# EAGLE design top_board (EAGLE 9.6.2)
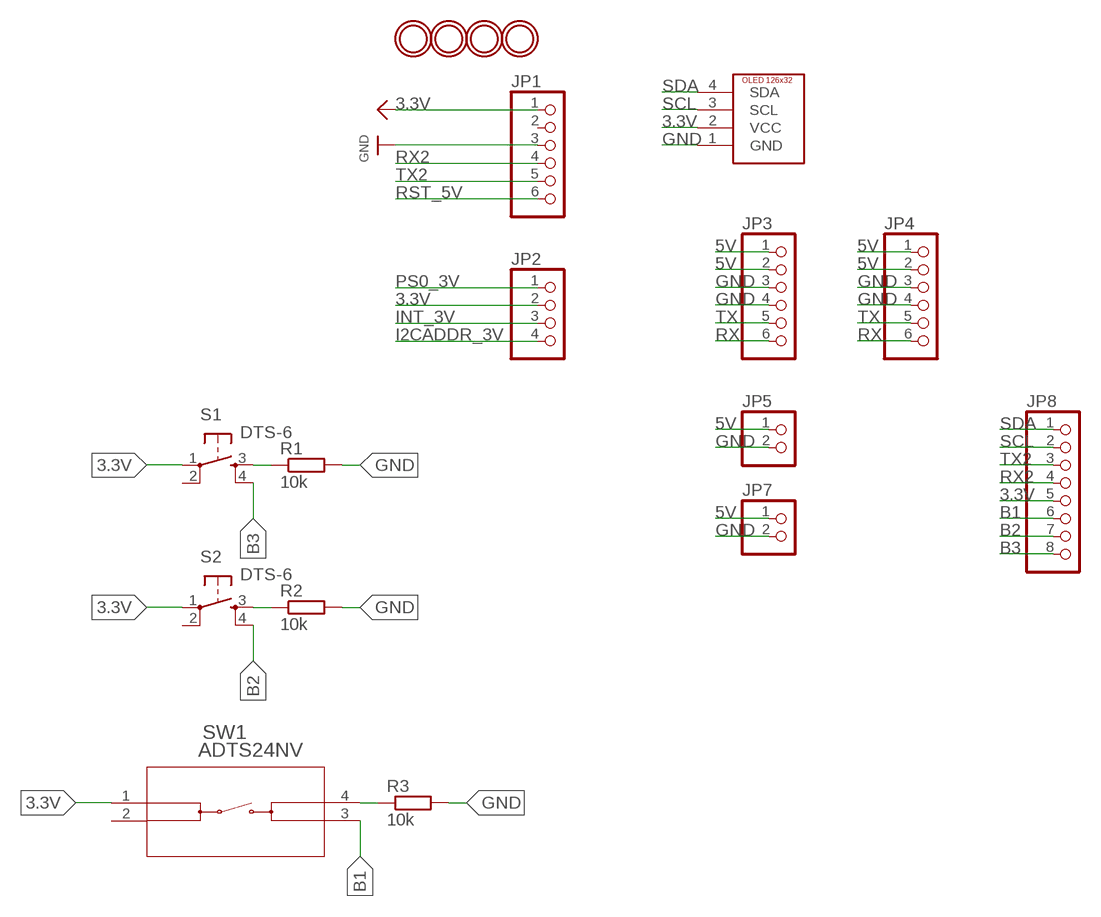
[diagram p0: schematic, sheet 1]

## Parts
JP1  HEADER-1X676MIL  [1X06_ROUND_76]
JP2  HEADER-1X476MIL  [1X04_ROUND_76]
JP3  PINHD-1X6  [1X06]
JP4  PINHD-1X6  [1X06]
JP5  PINHD-1X2  [1X02]
JP7  PINHD-1X2  [1X02]
JP8  PINHD-1X8  [1X08]
R1  10k  R-EU_R0603  [R0603]
R2  10k  R-EU_R0603  [R0603]
R3  10k  R-EU_R0603  [R0603]
S1  DTS-6  [DTS-6]
S2  DTS-6  [DTS-6]
SW1  ADTS24NV  [ADTS24*V_APM]
U$1  OLED126X32THROUGH_HOLE  [OLED128X64]
U$29  MOUNTINGHOLE2.5_THICK  [MOUNTINGHOLE_2.5_PLATED_THICK]
U$30  MOUNTINGHOLE2.5_THICK  [MOUNTINGHOLE_2.5_PLATED_THICK]
U$31  MOUNTINGHOLE2.5_THICK  [MOUNTINGHOLE_2.5_PLATED_THICK]
U$32  MOUNTINGHOLE2.5_THICK  [MOUNTINGHOLE_2.5_PLATED_THICK]

## Nets
3.3V: JP1.1 JP2.2 JP8.5 S1.1 S2.1 SW1.1 U$1.2(VCC) ; supply symbol labelled 5.0V
5V: JP3.1 JP3.2 JP4.1 JP4.2 JP5.1 JP7.1
B1: JP8.6 SW1.3
B2: JP8.7 S2.4
B3: JP8.8 S1.4
GND: JP1.3 JP3.3 JP3.4 JP4.3 JP4.4 JP5.2 JP7.2 R1.2 R2.2 R3.2 U$1.1(GND)
I2CADDR_3V: JP2.4
INT_3V: JP2.3
N$1: R1.1 S1.3
N$2: R2.1 S2.3
N$3: R3.1 SW1.4
PS0_3V: JP2.1
RST_5V: JP1.6
RX: JP3.6 JP4.6
RX2: JP1.4 JP8.4
SCL: JP8.2 U$1.3(SCL)
SDA: JP8.1 U$1.4(SDA)
TX: JP3.5 JP4.5
TX2: JP1.5 JP8.3
Unconnected: JP1.2 S1.2 S2.2 SW1.2

## Library data of the parts
JP1 = microbuilder:HEADER-1X6: PIN HEADER
JP2 = microbuilder:HEADER-1X4: PIN HEADER
JP3 JP4 = pinhead:PINHD-1X6: PIN HEADER
JP5 JP7 = pinhead:PINHD-1X2: PIN HEADER
JP8 = pinhead:PINHD-1X8: PIN HEADER
R1-R3 = rcl:R-EU_: RESISTOR, European symbol; SPICEPREFIX: R
S1 S2 = switch-tact:DTS-6
SW1 = big button:ADTS24NV; COPYRIGHT: Copyright (C) 2023 Ultra Librarian. All rights reserved.; MANUFACTURER_PART_NUMBER: ADTS24NV; MFR_NAME: Apem
U$1 = OLED 128x32:OLED126X32
U$29-U$32 = microbuilder:MOUNTINGHOLE: Mounting Hole For #2 screws (0.086"/2.18mm width, 0.094"/2.4mm hole) use 2.5mm; BOM: EXCLUDE

## Board
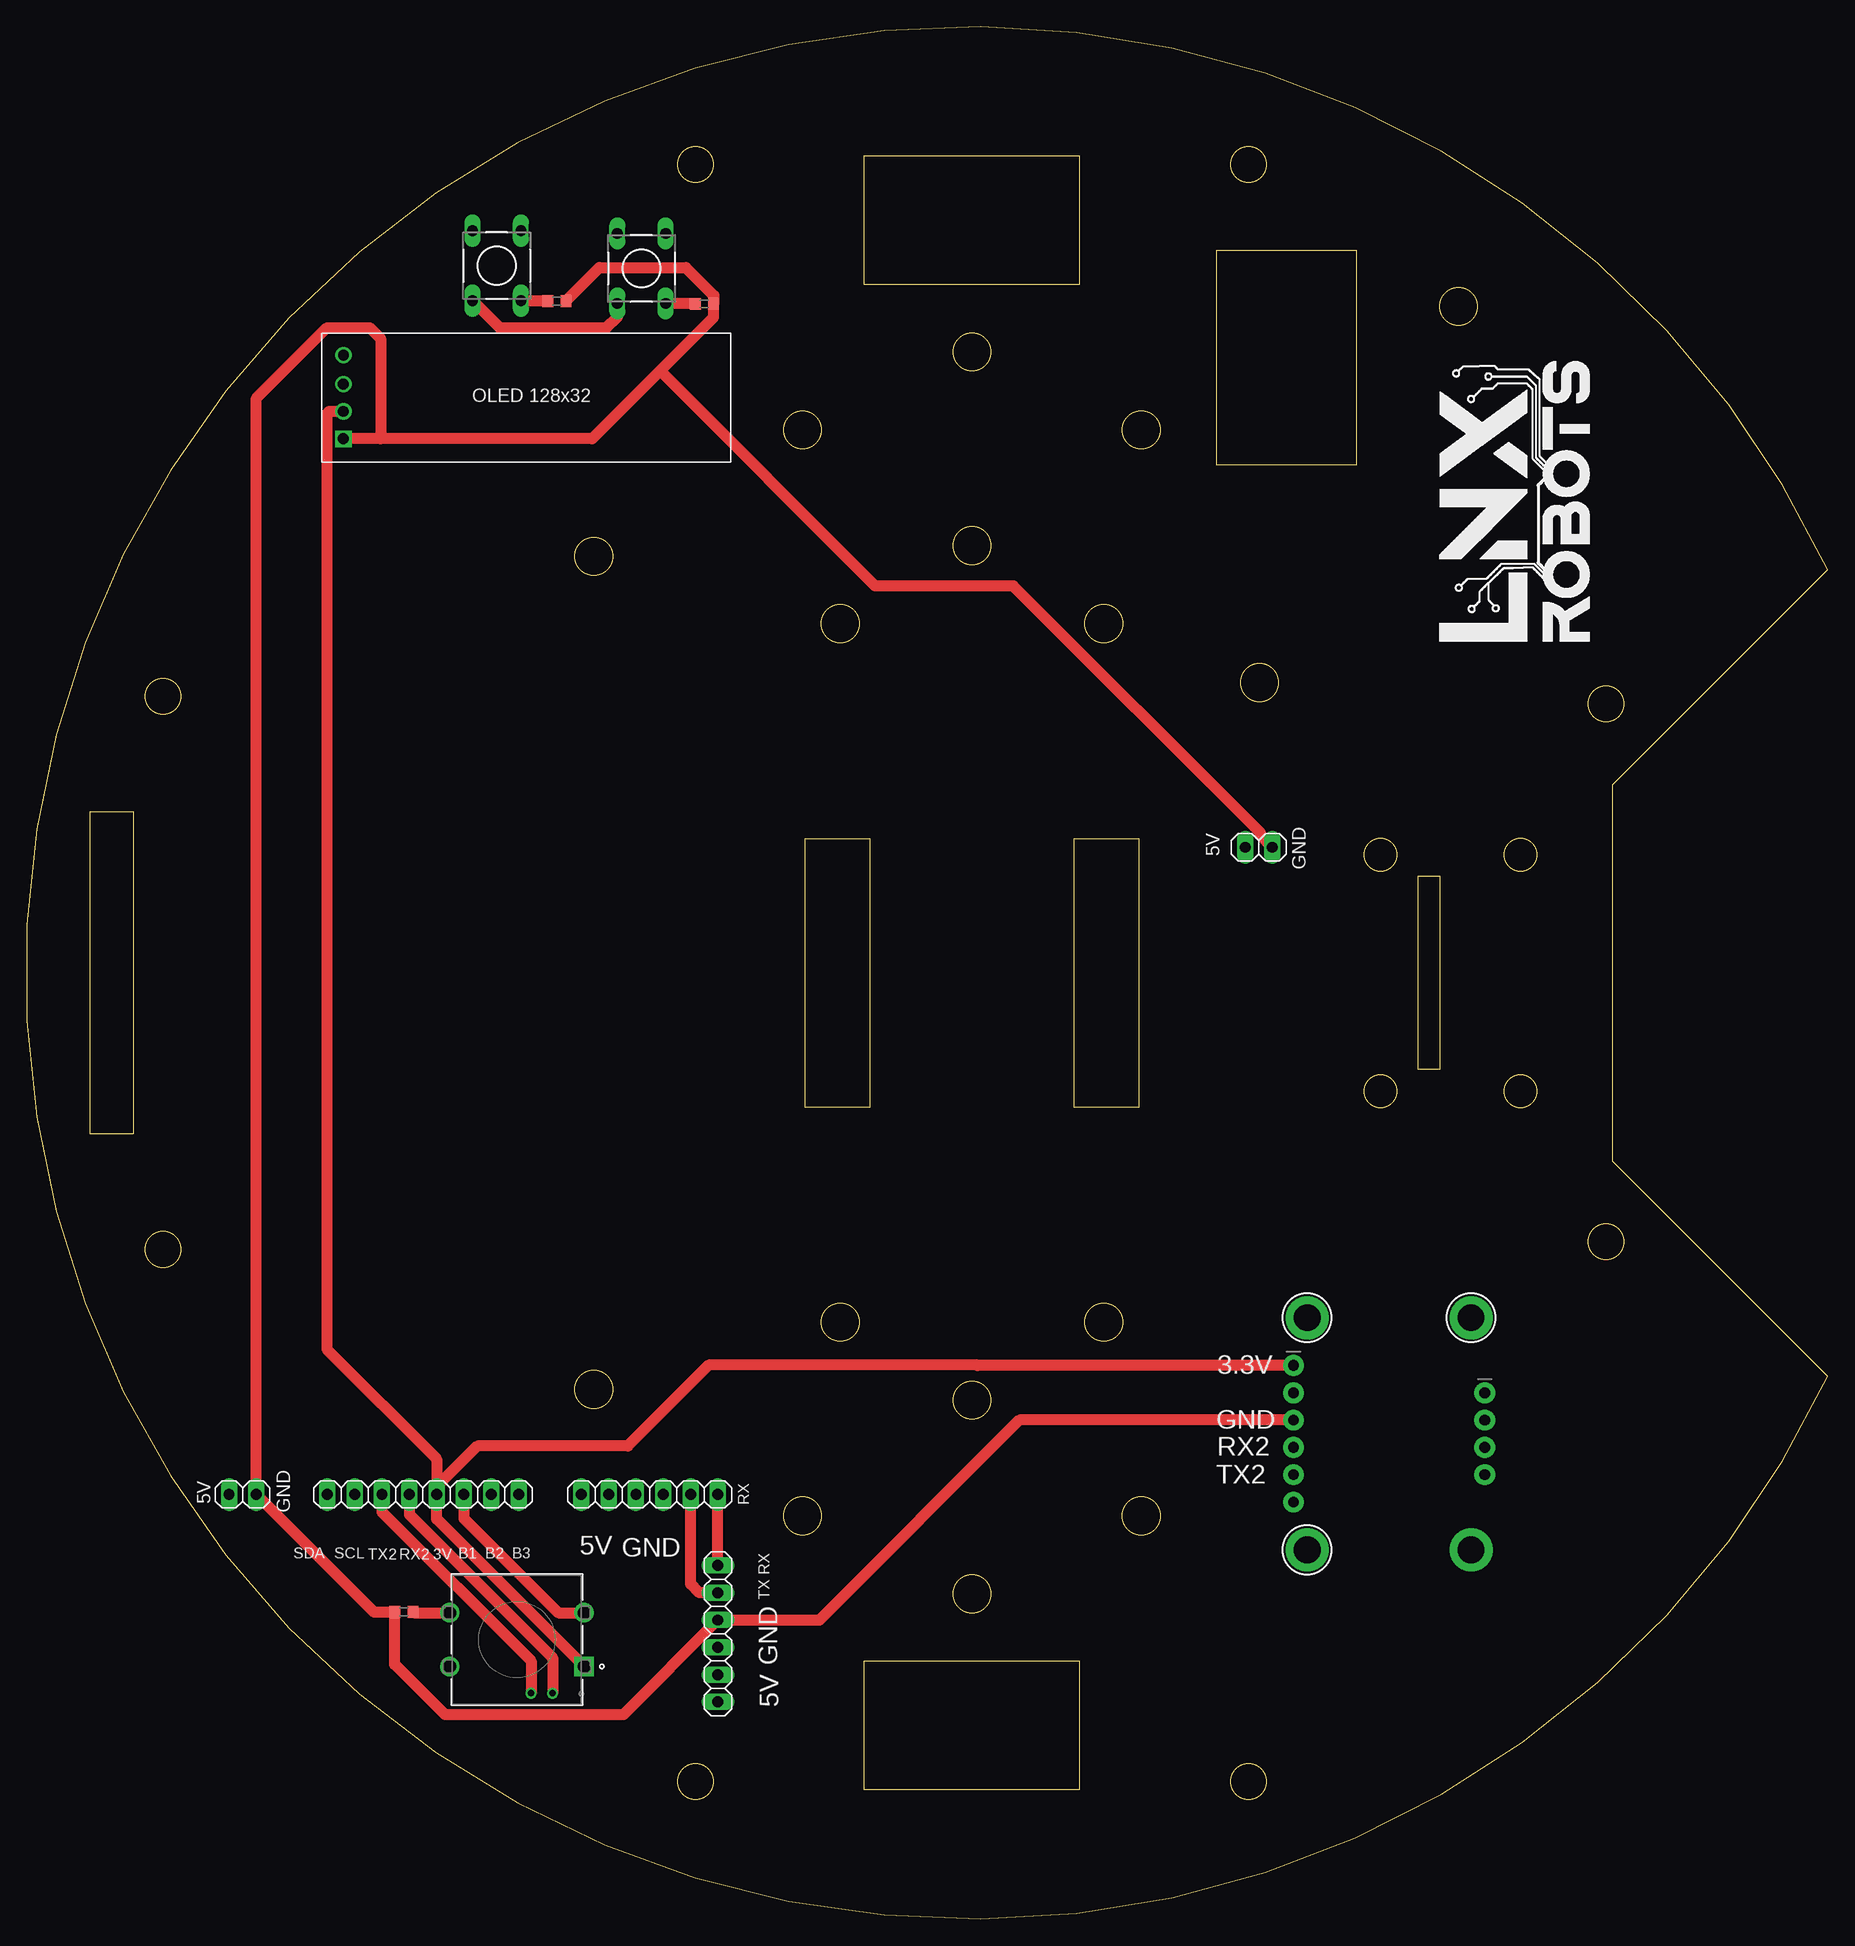
[diagram p1: board, top side]
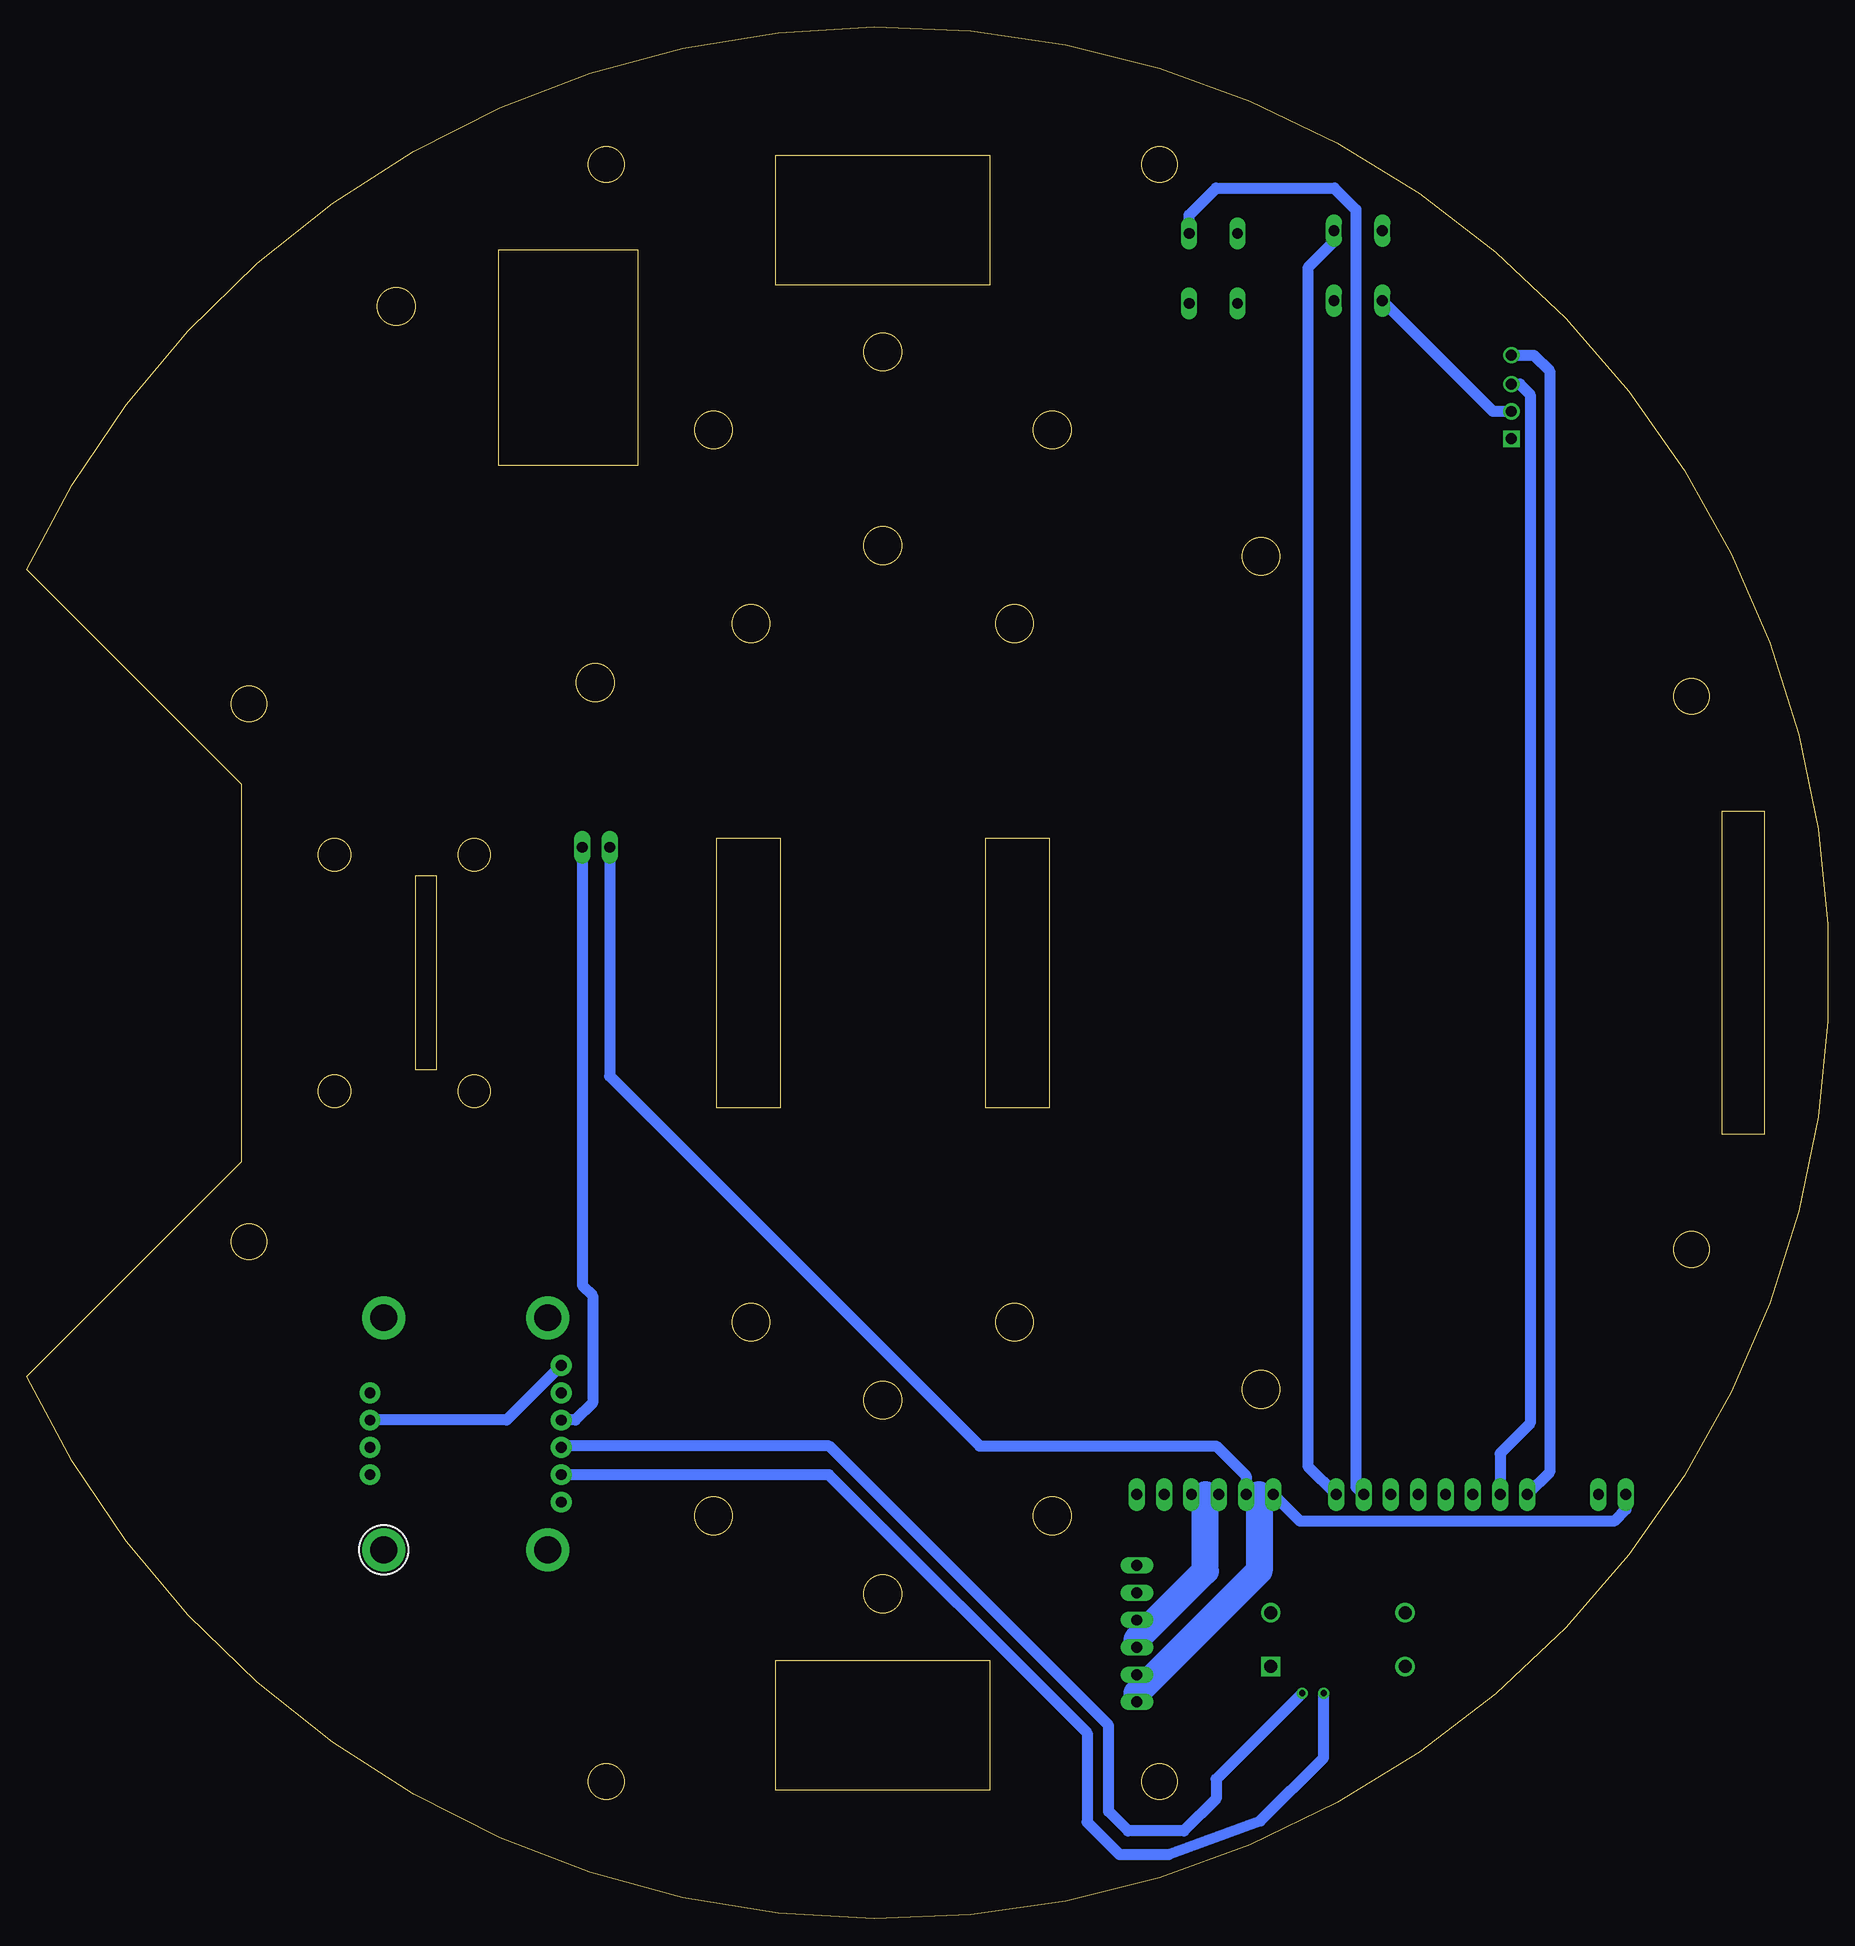
[diagram p2: board, bottom side, seen from below]

Size 167.48 x 175.99 mm. Coordinates in mm from the lower left corner, seen from the top.
Outline: 123.64,135.21 110.64,135.21 110.64,155.21 123.64,155.21 123.64,135.21
Outline: 97.89,12 77.89,12 77.89,24 97.89,24 97.89,12
Outline: 9.89,103 9.89,73 5.89,73 5.89,103 9.89,103
Outline: 131.39,79 129.39,79 129.39,97 131.39,97 131.39,79
Outline: 72.39,75.5 72.39,100.5 78.39,100.5 78.39,75.5 72.39,75.5
Outline: 77.89,152 77.89,164 97.89,164 97.89,152 77.89,152
Outline: 103.39,100.5 103.39,75.5 97.39,75.5 97.39,100.5 103.39,100.5
Outline: 147.48,70.47 147.48,105.52 167.48,125.52 arc310 167.48,50.47 147.48,70.47
Outline: circle at 125.89,99 radius 1.5
Outline: circle at 75.64,120.5 radius 1.75
Outline: circle at 87.89,30.25 radius 1.75
Outline: circle at 146.84,113.01 radius 1.65
Outline: circle at 87.89,48.25 radius 1.75
Outline: circle at 138.89,77 radius 1.5
Outline: circle at 100.14,120.5 radius 1.75
Outline: circle at 72.14,37.5 radius 1.75
Outline: circle at 114.64,115 radius 1.75
Outline: circle at 52.72,126.75 radius 1.75
Outline: circle at 103.64,37.5 radius 1.75
Outline: circle at 72.14,138.5 radius 1.75
Outline: circle at 52.72,49.25 radius 1.75
Outline: circle at 12.67,113.72 radius 1.65
Outline: circle at 133.14,150 radius 1.75
Outline: circle at 125.89,77 radius 1.5
Outline: circle at 103.64,138.5 radius 1.75
Outline: circle at 87.89,145.75 radius 1.75
Outline: circle at 62.17,12.78 radius 1.65
Outline: circle at 113.61,12.78 radius 1.65
Copper layers (1*16): Top 0.035mm / dielectric 1.5mm / Bottom 0.035mm
Design rules "default": minimum track width 6mil, minimum drill 0.35mm, track to track 6mil, track to pad 6mil, pad to pad 6mil, via to via 6mil, smd to smd 6mil, copper to edge 40mil, drill to drill 6mil, minimum pad ring 10mil, minimum via ring 8mil, stop-mask expansion 4mil, vias tented up to drill 0mil, thermal gap 10mil

### Footprints (pad centres in the part's own frame; a part is rotated, then mirrored left to right if it is on the bottom)
1X06_ROUND_76 = drill 1 pad 1.93: 1 -6.35,0; 2 -3.81,0; 3 -1.27,0; 4 1.27,0; 5 3.81,0; 6 6.35,0
1X04_ROUND_76 = drill 1 pad 1.93: 1 -3.81,0; 2 -1.27,0; 3 1.27,0; 4 3.81,0
1X06 = drill 1.016 long: 1 -6.35,0; 2 -3.81,0; 3 -1.27,0; 4 1.27,0; 5 3.81,0; 6 6.35,0
1X02 = drill 1.016 long: 1 -1.27,0; 2 1.27,0
1X08 = drill 1.016 long: 1 -8.89,0; 2 -6.35,0; 3 -3.81,0; 4 -1.27,0; 5 1.27,0; 6 3.81,0; 7 6.35,0; 8 8.89,0
R0603 = smd 1 x 1.1: 1 -0.85,0; 2 0.85,0
DTS-6 = drill 1 long: 1 -3.25,2.25; 2 3.25,2.25; 3 -3.25,-2.25; 4 3.25,-2.25
ADTS24*V_APM = drill 1.194 pad 1.702 square: 1 0,0 | drill 1.194 pad 1.702: 2 12.497,0; 3 0,-5.004; 4 12.497,-5.004
OLED128X64 = drill 1.016 square: 1 2,2.19 | drill 1.016: 2 2,4.73; 3 2,7.27; 4 2.009,9.961
MOUNTINGHOLE_2.5_PLATED_THICK = drill 2.5 pad 4: P$1 0,0

### Placement (x,y rotation side)
JP1  117.79,45.13 270 top
JP2  135.57,45.13 270 top
JP3  57.91,39.48 0 top
JP4  64.26,26.53 90 top
JP5  20.07,39.48 0 top
JP7  114.56,99.68 0 top
JP8  36.83,39.48 0 top
R1  49.28,150.48 0 top
R2  62.99,150.23 0 top
R3  35.05,28.56 180 top
S1  43.69,153.78 90 top
S2  57.15,153.53 90 top
SW1  51.82,23.48 180 top
U$1  27.43,135.49 0 top
U$29  119.06,34.33 270 top
U$30  134.3,34.33 90 bottom
U$31  119.06,55.92 270 top
U$32  134.3,55.92 270 top

### Tracks (layer width: path | path; a pad name or v marks a point on that pad's centre or on a via)
3.3V
  Top 1.016: SW1.1 38.1,37.2 JP8.5 | JP1.1 88.41,51.48 88.37,51.52 63.41,51.52 55.89,44 41.89,44 38.1,40.21 JP8.5 | S1.1 43.98,148 53.89,148 54.9,149.01 S2.1 | U$1.2 28.11,140.22 27.89,140 27.89,53 38.1,42.78 JP8.5
  Bottom 1.016: JP1.1 122.87,46.4 JP2.2 | U$1.2 31.13,140.22 S1.1
5V
  Bottom 1.016: JP4.1 64.26,21 JP4.2 | JP5.1 18.8,38.08 19.89,37 49.08,37 JP3.1 52.89,39.48 JP3.2 54.1,41.21 56.89,44 78.89,44 113.29,78.4 JP7.1
  Bottom 2.5: 52.89,39.48 52.89,32.37 64.26,21
B1
  Top 1.016: JP8.6 40.64,37.24 49.4,28.48 SW1.3
B2
  Bottom 1.016: S2.4 59.4,158.48 56.89,161 45.89,161 43.89,159 43.89,40.19 JP8.7
B3
  Bottom 1.016: S1.4 45.94,156 48.35,153.58 48.35,42.11 JP8.8
GND
  Top 1.016: JP1.3 92.29,46.4 73.69,27.8 JP4.4 55.46,19 38.89,19 34.2,23.68 R3.2 32.26,28.56 JP5.2 21.34,141.45 27.89,148 31.89,148 32.89,147 32.89,137.68 | R1.2 53.24,153.6 61.29,153.6 63.89,151 63.89,150.27 R2.2 63.84,148.95 58.89,144 | 32.89,137.68 52.57,137.68 58.89,144 | 32.89,137.68 U$1.1 | JP7.2 114.71,100.8 114.71,101.03 91.74,124 78.89,124 58.89,144
  Bottom 1.016: JP4.3 64.26,26 JP4.4 | JP3.4 57.89,39.48 JP3.3 | JP7.2 115.83,58.94 114.89,58 114.89,48 116.48,46.4 JP1.3
  Bottom 2.5: 64.26,26 57.89,32.37 57.89,39.48
N$1
  Top 1.016: R1.1 45.99,150.48 S1.3
N$2
  Top 1.016: S2.3 62.09,150.28 R2.1
N$3
  Top 1.016: R3.1 35.98,28.48 SW1.4
RX
  Top 1.016: JP4.6 JP3.6
RX2  (via drill 0.6)
  Top 1.016: JP8.4 35.56,37.62 48.89,24.3 v48.89,21
  Bottom 1.016: JP1.4 117.65,44 92.89,44 66.89,18 66.89,10 65.09,8.2 59.89,8.2 56.89,11.2 56.89,13 v48.89,21
SCL
  Bottom 1.016: U$1.3 28.65,142.76 27.69,141.8 27.69,46.1 30.49,43.3 JP8.2
SDA
  Bottom 1.016: U$1.4 27.34,145.46 25.89,144 25.89,41.54 JP8.1
TX
  Top 1.016: JP4.5 62.54,30.34 61.72,31.16 JP3.5
TX2  (via drill 0.6)
  Top 1.016: JP8.3 33.02,37.86 46.89,24 v46.89,21
  Bottom 1.016: JP1.5 92.91,41.32 68.89,17.3 68.89,9 65.89,6 61.28,6 52.77,9.11 46.89,15 v46.89,21

### Text on the board
tPlace: 5V | GND | 3.3V | GND | RX2 | TX2 | 5V | GND | RX | SDA | SCL | B1 | B2 | B3 | 5V | GND | TX2 | RX2 | 3V | RX | TX | GND | 5V